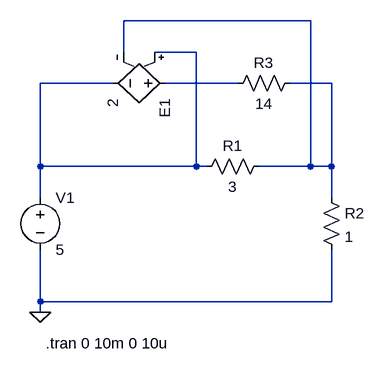
[diagram p0: schematic vcvs - voltage controlled voltage source.asc]
vcvs - voltage controlled voltage source.asc, the LTspice schematic file:
Version 4.1
SHEET 1 880 680
WIRE 432 -112 144 -112
WIRE 144 -64 144 -112
WIRE 256 -64 192 -64
WIRE 128 -16 16 -16
WIRE 320 -16 208 -16
WIRE 464 -16 400 -16
WIRE 16 112 16 -16
WIRE 256 112 256 -64
WIRE 256 112 16 112
WIRE 272 112 256 112
WIRE 432 112 432 -112
WIRE 432 112 352 112
WIRE 464 112 464 -16
WIRE 464 112 432 112
WIRE 16 160 16 112
WIRE 464 160 464 112
WIRE 16 320 16 240
WIRE 464 320 464 240
WIRE 464 320 16 320
WIRE 16 336 16 320
FLAG 16 336 0
SYMBOL voltage 16 144 R0
SYMATTR InstName V1
SYMATTR Value 5
SYMBOL res 368 96 R90
WINDOW 0 0 56 VBottom 2
WINDOW 3 32 56 VTop 2
SYMATTR InstName R1
SYMATTR Value 3
SYMBOL res 448 144 R0
SYMATTR InstName R2
SYMATTR Value 1
SYMBOL e 224 -16 R90
SYMATTR InstName E1
SYMATTR Value 2
SYMBOL res 416 -32 R90
WINDOW 0 0 56 VBottom 2
WINDOW 3 32 56 VTop 2
SYMATTR InstName R3
SYMATTR Value 14
TEXT 24 384 Left 2 !.tran 0 10m 0 10u

The netlist it stands for:
* vcvs - voltage controlled voltage source.asc
V1 N002 0 5
R1 N001 N002 3
R2 N001 0 1
E1 N003 N002 N002 N001 2
R3 N001 N003 14
.tran 0 10m 0 10u
.backanno
.end